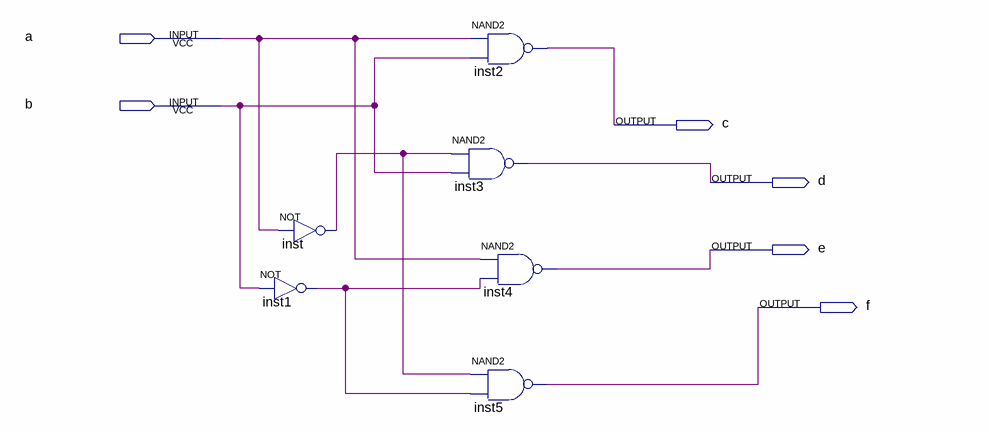
[diagram p0: schematic sheet]
// Quartus schematic ersi.bdf as structural Verilog: 6 symbols, 6 pins
module ersi (
  input  a,
  input  b,
  output c,
  output d,
  output e,
  output f
);

  wire inst1_out, inst_out;

  not inst (inst_out, a);
  not inst1 (inst1_out, b);
  nand inst2 (c, a, b);
  nand inst3 (d, inst_out, b);
  nand inst5 (f, inst_out, inst1_out);
  nand inst4 (e, a, inst1_out);
endmodule
